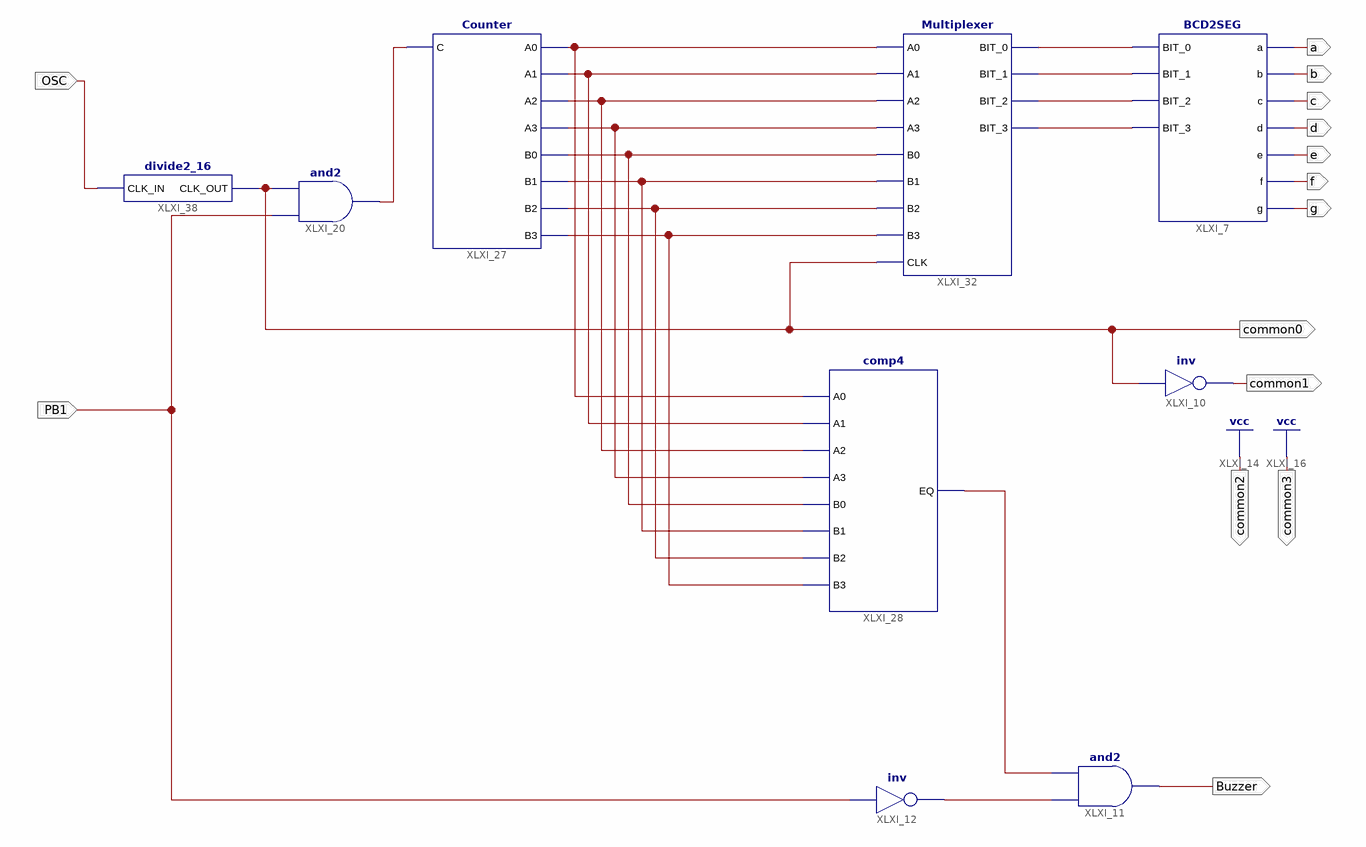
[diagram p0: schematic sheet 1]
// Xilinx ISE schematic RANDOM.sch (spartan6) as structural Verilog: 9 symbols, 14 ports
module RANDOM (
  input  PB1,
  input  OSC,
  output common1,
  output Buzzer,
  output common0,
  output common2,
  output common3,
  output a,
  output b,
  output c,
  output d,
  output e,
  output f,
  output g
);

  wire XLXN_3, XLXN_20, XLXN_24, XLXN_25, XLXN_26, XLXN_27, XLXN_28, XLXN_29, XLXN_30, XLXN_37, XLXN_61,
       XLXN_101, XLXN_120, XLXN_121, XLXN_122;

  not XLXI_10 (common1, common0);
  and XLXI_11 (Buzzer, XLXN_37, XLXN_61);
  not XLXI_12 (XLXN_37, PB1);
  and XLXI_20 (XLXN_101, PB1, common0);
  Counter XLXI_27 (
    .C(XLXN_101), .A0(XLXN_20), .A1(XLXN_24), .A2(XLXN_25), .A3(XLXN_26), .B0(XLXN_27), .B1(XLXN_28),
    .B2(XLXN_29), .B3(XLXN_30));
  comp4 XLXI_28 (
    .A0(XLXN_20), .A1(XLXN_24), .A2(XLXN_25), .A3(XLXN_26), .B0(XLXN_27), .B1(XLXN_28), .B2(XLXN_29),
    .B3(XLXN_30), .EQ(XLXN_61));
  Multiplexer XLXI_32 (
    .CLK(common0), .B3(XLXN_30), .A3(XLXN_26), .B2(XLXN_29), .A2(XLXN_25), .B1(XLXN_28), .A1(XLXN_24),
    .A0(XLXN_20), .B0(XLXN_27), .BIT_0(XLXN_3), .BIT_1(XLXN_120), .BIT_2(XLXN_121), .BIT_3(XLXN_122));
  BCD2SEG XLXI_7 (
    .BIT_0(XLXN_3), .BIT_1(XLXN_120), .BIT_2(XLXN_121), .BIT_3(XLXN_122), .a(a), .c(c), .d(d), .e(e), .f(f),
    .g(g), .b(b));
  divide2_16 XLXI_38 (.CLK_IN(OSC), .CLK_OUT(common0));

  assign common2 = 1'b1;
  assign common3 = 1'b1;
endmodule
